# EAGLE design rc2014_lcd (EAGLE 6.5.0)
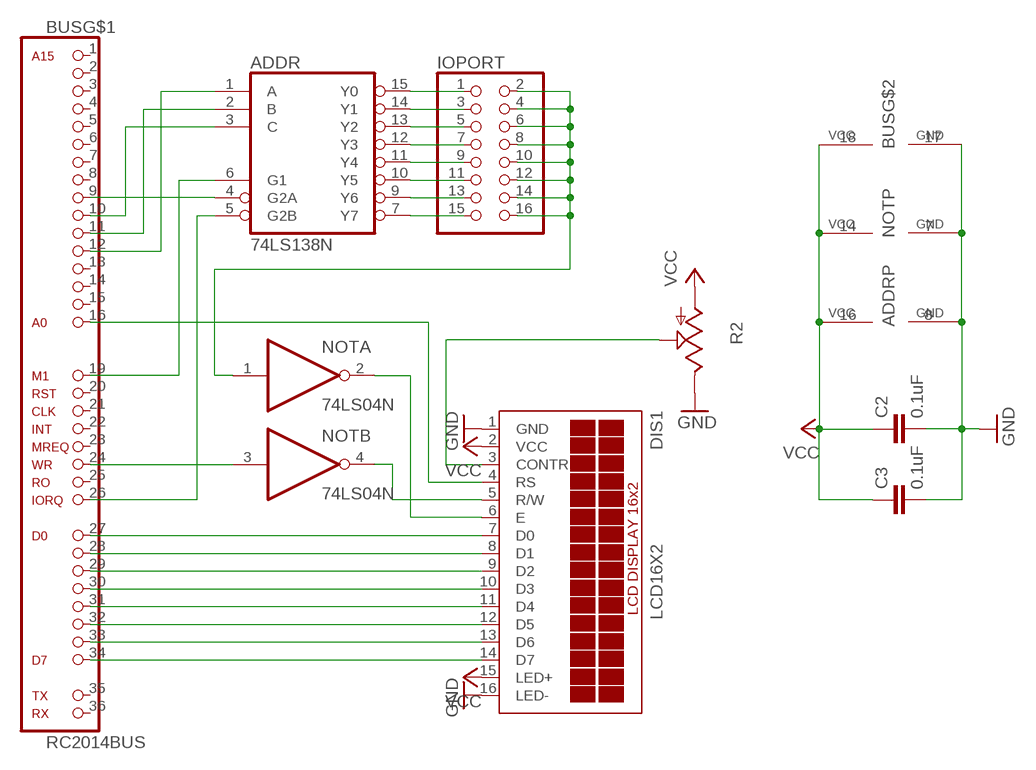
[diagram p0: schematic, sheet 1]

## Parts
ADDR  74LS138N  [DIL16]
BUS  RC2014BUS  [1X39]
C2  0.1uF  C-EU050-024X044  [C050-024X044]
C3  0.1uF  C-EU050-024X044  [C050-024X044]
DIS1  LCD16X2  [1X16]
IOPORT  PINHD-2X8  [2X08]
NOT  74LS04N  [DIL14]
R2  TRIM_US-B25P  [B25P]

## Nets
GND: ADDR.8(GND) BUS.17(GND) C2.2 C3.2 DIS1.1(GND) DIS1.16(LED-) NOT.7(P:GND) R2.E
N$1: ADDR.6(G1) BUS.19(M1)
N$2: ADDR.5(G2B) BUS.26(IORQ)
N$3: ADDR.4(G2A) BUS.9(A7)
N$4: ADDR.3(C) BUS.10(A6)
N$5: ADDR.2(B) BUS.11(A5)
N$6: ADDR.1(A) BUS.12(A4)
N$7: ADDR.15(Y0) IOPORT.1
N$8: ADDR.14(Y1) IOPORT.3
N$9: ADDR.13(Y2) IOPORT.5
N$10: ADDR.12(Y3) IOPORT.7
N$11: ADDR.11(Y4) IOPORT.9
N$12: ADDR.10(Y5) IOPORT.11
N$13: ADDR.9(Y6) IOPORT.13
N$14: ADDR.7(Y7) IOPORT.15
N$15: IOPORT.2 IOPORT.4 IOPORT.6 IOPORT.8 IOPORT.10 IOPORT.12 IOPORT.14 IOPORT.16 NOT.1(A:I)
N$16: BUS.27(D0) DIS1.7(D0)
N$17: BUS.28(D1) DIS1.8(D1)
N$18: BUS.29(D2) DIS1.9(D2)
N$19: BUS.30(D3) DIS1.10(D3)
N$20: BUS.31(D4) DIS1.11(D4)
N$21: BUS.32(D5) DIS1.12(D5)
N$22: BUS.33(D6) DIS1.13(D6)
N$23: BUS.34(D7) DIS1.14(D7)
N$24: BUS.24(WR) NOT.3(B:I)
N$25: DIS1.5(R/W) NOT.4(B:O)
N$26: BUS.16(A0) DIS1.4(RS)
N$27: DIS1.6(E) NOT.2(A:O)
N$30: DIS1.3(CONTR) R2.S
VCC: ADDR.16(VCC) BUS.18(VCC) C2.1 C3.1 DIS1.2(VCC) DIS1.15(LED+) NOT.14(P:VCC) R2.A
Unconnected: BUS.1(A15) BUS.2(A14) BUS.3(A13) BUS.4(A12) BUS.5(A11) BUS.6(A10) BUS.7(A9) BUS.8(A8) BUS.13(A3) BUS.14(A2) BUS.15(A1) BUS.20(RST) BUS.21(CLK) BUS.22(INT) BUS.23(MREQ) BUS.25(RO) BUS.35(TX) BUS.36(RX) NOT.5(C:I) NOT.6(C:O) NOT.8(D:O) NOT.9(D:I) NOT.10(E:O) NOT.11(E:I) NOT.12(F:O) NOT.13(F:I)

## Library data of the parts
ADDR = 74xx-us:74*138: 3-line to 8-line DECODER/DEMULTIPLEXER
BUS = logick:RC2014BUS
C2 C3 = rcl:C-EU: CAPACITOR, European symbol
DIS1 = logick:LCD16X2
IOPORT = pinhead:PINHD-2X8: PIN HEADER
NOT = 74xx-us:74*04: Hex INVERTER
R2 = pot:TRIM_US-: POTENTIOMETER

## Net classes
0 +5V: width 0.508 mm

## Board
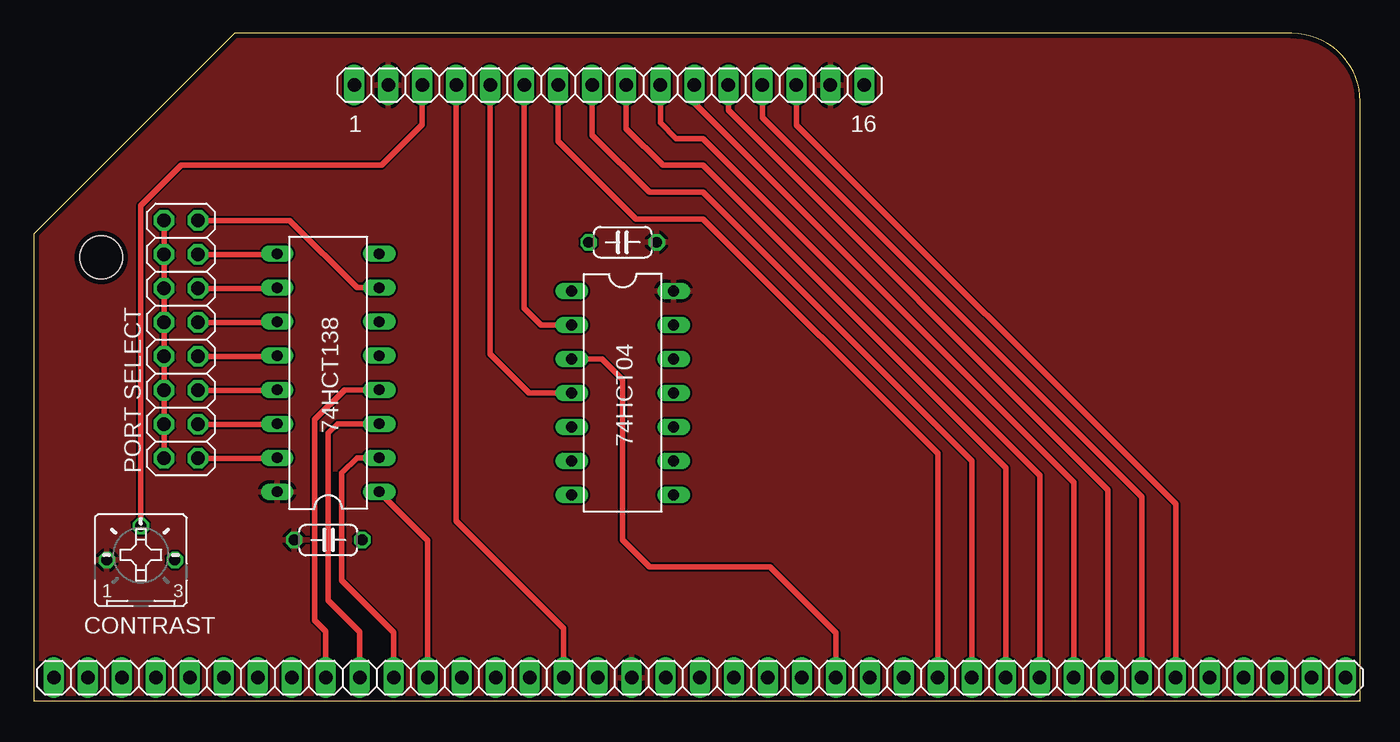
[diagram p1: board, top side]
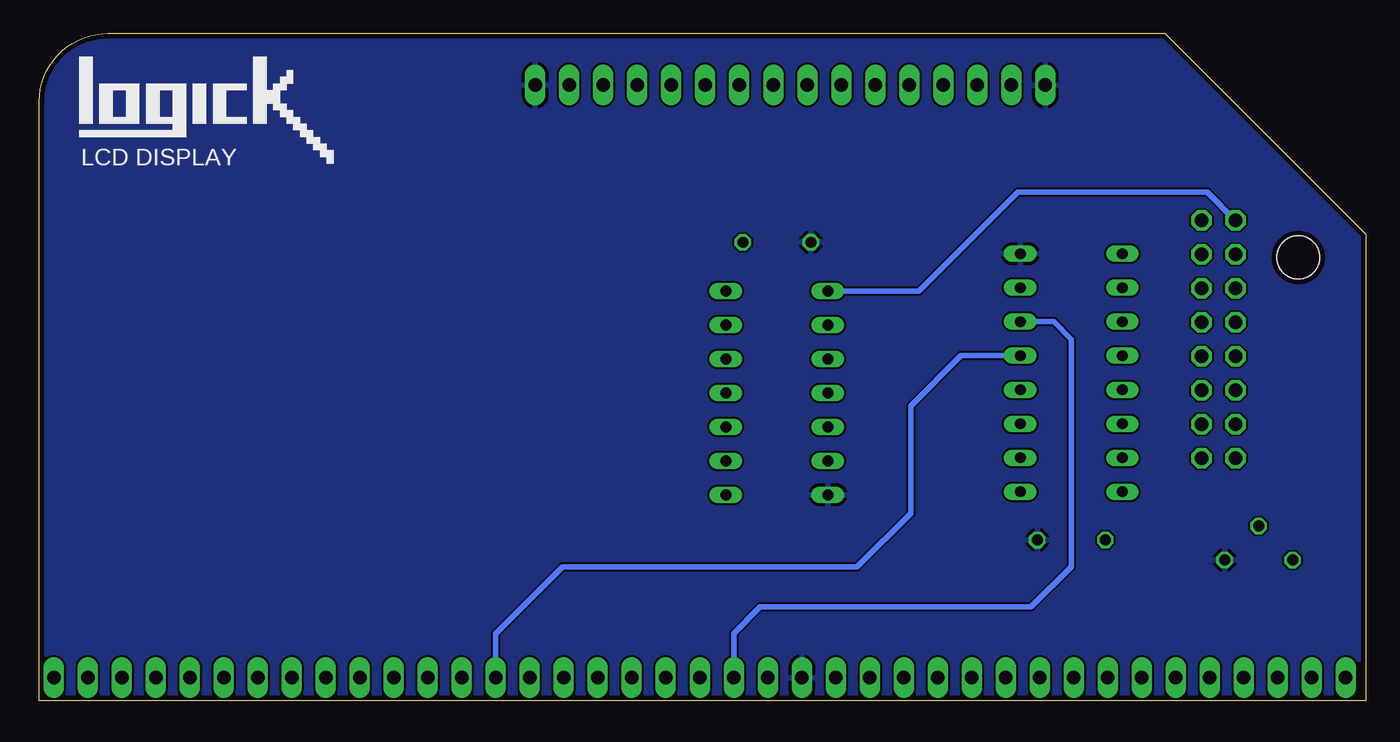
[diagram p2: board, bottom side, seen from below]

Size 99.11 x 49.86 mm. Coordinates in mm from the lower left corner, seen from the top.
Outline: 0,0 99.11,0 99.11,44.76 arc90 94.01,49.86 15.01,49.86 0,34.85 0,0
Copper layers (1*16): Top 0.0356mm / dielectric 1.5011mm / Bottom 0.0356mm
Design rules "oshpark-2layer": minimum track width 6mil, minimum drill 13mil, track to track 6mil, track to pad 6mil, pad to pad 6mil, via to via 6mil, smd to smd 6mil, copper to edge 15mil, drill to drill 6mil, minimum pad ring 7mil, minimum via ring 7mil, stop-mask expansion 2.5mil, vias tented up to drill 0mil, thermal gap 10mil
Holes 3.2 mm at 5.03,33.12

### Footprints (pad centres in the part's own frame; a part is rotated, then mirrored left to right if it is on the bottom)
DIL16 = drill 0.813 long: 1 -8.89,-3.81; 2 -6.35,-3.81; 3 -3.81,-3.81; 4 -1.27,-3.81; 5 1.27,-3.81; 6 3.81,-3.81; 7 6.35,-3.81; 8 8.89,-3.81; 9 8.89,3.81; 10 6.35,3.81; 11 3.81,3.81; 12 1.27,3.81; 13 -1.27,3.81; 14 -3.81,3.81; 15 -6.35,3.81; 16 -8.89,3.81
1X39 = drill 1.016 long: 1 0,0; 2 2.54,0; 3 5.08,0; 4 7.62,0; 5 10.16,0; 6 12.7,0; 7 15.24,0; 8 17.78,0; 9 20.32,0; 10 22.86,0; 11 25.4,0; 12 27.94,0; 13 30.48,0; 14 33.02,0; 15 35.56,0; 16 38.1,0; 17 40.64,0; 18 43.18,0; 19 45.72,0; 20 48.26,0; 21 50.8,0; 22 53.34,0; 23 55.88,0; 24 58.42,0; 25 60.96,0; 26 63.5,0; 27 66.04,0; 28 68.58,0; 29 71.12,0; 30 73.66,0; 31 76.2,0; 32 78.74,0; 33 81.28,0; 34 83.82,0; 35 86.36,0; 36 88.9,0; 37 91.44,0; 38 93.98,0; 39 96.52,0
C050-024X044 = drill 0.813 octagon: 1 -2.54,0; 2 2.54,0
1X16 = drill 1.016 long: 1 -19.05,0; 2 -16.51,0; 3 -13.97,0; 4 -11.43,0; 5 -8.89,0; 6 -6.35,0; 7 -3.81,0; 8 -1.27,0; 9 1.27,0; 10 3.81,0; 11 6.35,0; 12 8.89,0; 13 11.43,0; 14 13.97,0; 15 16.51,0; 16 19.05,0
2X08 = drill 1.016 octagon: 1 -8.89,-1.27; 2 -8.89,1.27; 3 -6.35,-1.27; 4 -6.35,1.27; 5 -3.81,-1.27; 6 -3.81,1.27; 7 -1.27,-1.27; 8 -1.27,1.27; 9 1.27,-1.27; 10 1.27,1.27; 11 3.81,-1.27; 12 3.81,1.27; 13 6.35,-1.27; 14 6.35,1.27; 15 8.89,-1.27; 16 8.89,1.27
DIL14 = drill 0.813 long: 1 -7.62,-3.81; 2 -5.08,-3.81; 3 -2.54,-3.81; 4 0,-3.81; 5 2.54,-3.81; 6 5.08,-3.81; 7 7.62,-3.81; 8 7.62,3.81; 9 5.08,3.81; 10 2.54,3.81; 11 0,3.81; 12 -2.54,3.81; 13 -5.08,3.81; 14 -7.62,3.81
B25P = drill 0.813 octagon: A -2.54,0; E 2.54,0; S 0,2.54

### Placement (x,y rotation side)
ADDR  22,24.5 90 top
BUS  1.5,1.72 0 top
C2  22,12 0 top
C3  44,34.25 180 top
DIS1  43,46 0 top
IOPORT  11,27 90 top
NOT  44,23 270 top
R2  8,10.5 0 top

### Tracks (layer width: path | path; a pad name or v marks a point on that pad's centre or on a via)
GND
  pour Bottom: 100,-1 -1,-1 -1,51 100,51
N$1
  Bottom 0.406: ADDR.6 23.31,28.31 22,27 22,10 25,7 45.25,7 47.22,5.03 BUS.19
N$2
  Bottom 0.406: ADDR.5 30.23,25.77 34,22 34,14 38,10 60,10 65,5 BUS.26
N$3
  Top 0.406: ADDR.4 23.23,23.23 21,21 21,6 21.82,5.18 BUS.9
N$4
  Top 0.406: ADDR.3 22.69,20.69 22,20 22,7.5 24.36,5.14 BUS.10
N$5
  Top 0.406: ADDR.2 24.15,18.15 23,17 23,9 26.9,5.1 BUS.11
N$6
  Top 0.406: BUS.12 29.44,11.98 ADDR.1
N$7
  Top 0.406: IOPORT.1 18.15,18.11 ADDR.15
N$8
  Top 0.406: IOPORT.3 18.15,20.65 ADDR.14
N$9
  Top 0.406: IOPORT.5 18.15,23.19 ADDR.13
N$10
  Top 0.406: IOPORT.7 18.15,25.73 ADDR.12
N$11
  Top 0.406: IOPORT.9 18.15,28.27 ADDR.11
N$12
  Top 0.406: IOPORT.11 18.15,30.81 ADDR.10
N$13
  Top 0.406: IOPORT.13 18.15,33.35 ADDR.9
N$14
  Top 0.406: IOPORT.15 19.11,35.89 24.15,30.85 ADDR.7
N$15
  Top 0.406: IOPORT.16 IOPORT.14 IOPORT.12 IOPORT.10 IOPORT.8 IOPORT.6 IOPORT.4 IOPORT.2
  Bottom 0.406: NOT.1 33.38,30.62 26,38 11.84,38 IOPORT.16
N$16
  Top 0.406: BUS.27 67.54,18.46 50,36 45,36 39.19,41.81 DIS1.7
N$17
  Top 0.406: BUS.28 70.08,17.92 50,38 46,38 41.73,42.27 DIS1.8
N$18
  Top 0.406: BUS.29 72.62,17.38 50,40 47,40 44.27,42.73 DIS1.9 44.27,45.73
N$19
  Top 0.406: BUS.30 75.16,16.84 50,42 48,42 46.81,43.19 DIS1.10
N$20
  Top 0.406: BUS.31 77.7,16.3 49.35,44.65 DIS1.11
N$21
  Top 0.406: BUS.32 80.24,15.76 51.89,44.11 DIS1.12
N$22
  Top 0.406: BUS.33 82.78,15.22 54.43,43.57 DIS1.13
N$23
  Top 0.406: BUS.34 85.32,14.68 57,43 57,45.97 DIS1.14
N$24
  Top 0.406: NOT.3 42.46,25.54 44,24 44,12 46,10 55,10 59.92,5.08 BUS.24
N$25
  Top 0.406: DIS1.5 34.11,25.89 37,23 NOT.4
N$26
  Top 0.406: DIS1.4 31.57,13.43 39.6,5.4 BUS.16
N$27
  Top 0.406: DIS1.6 36.65,29.35 37.92,28.08 NOT.2
N$30
  Top 0.406: R2.S 8,37 11,40 26,40 29.03,43.03 DIS1.3
VCC
  pour Top: 100,-1 -1,-1 -1,51 100,51

### Text on the board
tPlace: 1 | 16 | 74HCT138 | 74HCT04 | PORT SELECT | CONTRAST
bPlace: LCD DISPLAY